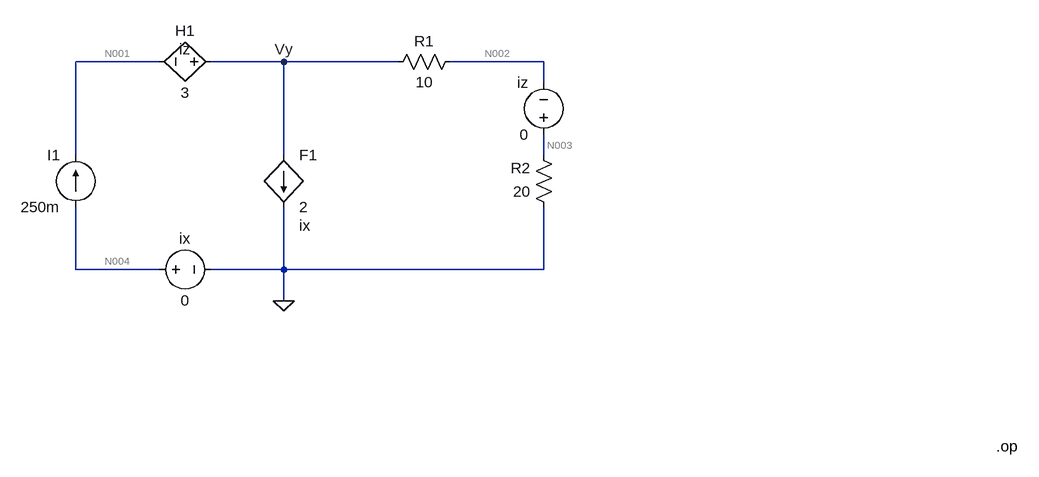
[diagram p0: schematic Lab03_01.asc]
Lab03_01.asc, the LTspice schematic file:
Version 4
SHEET 1 1408 680
WIRE 80 -80 -48 -80
WIRE 272 -80 160 -80
WIRE 448 -80 272 -80
WIRE 672 -80 528 -80
WIRE 672 -48 672 -80
WIRE -48 64 -48 -80
WIRE 272 64 272 -80
WIRE 672 64 672 32
WIRE -48 240 -48 144
WIRE 80 240 -48 240
WIRE 272 240 272 144
WIRE 272 240 160 240
WIRE 672 240 672 144
WIRE 672 240 272 240
WIRE 272 288 272 240
FLAG 272 288 0
FLAG 272 -80 Vy
SYMBOL current -48 144 R180
WINDOW 0 24 80 Left 2
WINDOW 3 24 0 Left 2
SYMATTR InstName I1
SYMATTR Value 250m
SYMBOL h 176 -80 R90
WINDOW 0 -32 56 VBottom 2
WINDOW 3 32 56 VTop 2
WINDOW 38 -4 56 VBottom 2
SYMATTR InstName H1
SYMATTR Value 3
SYMATTR SpiceModel iz
SYMBOL f 272 64 R0
WINDOW 38 24 108 Left 2
SYMATTR InstName F1
SYMATTR Value 2
SYMATTR SpiceModel ix
SYMBOL res 544 -96 R90
WINDOW 0 0 56 VBottom 2
WINDOW 3 32 56 VTop 2
SYMATTR InstName R1
SYMATTR Value 10
SYMBOL res 688 160 R180
WINDOW 0 36 76 Left 2
WINDOW 3 36 40 Left 2
SYMATTR InstName R2
SYMATTR Value 20
SYMBOL voltage 64 240 R270
WINDOW 0 32 56 VTop 2
WINDOW 3 -32 56 VBottom 2
SYMATTR InstName ix
SYMATTR Value 0
SYMBOL voltage 672 48 R180
WINDOW 0 24 96 Left 2
WINDOW 3 24 16 Left 2
SYMATTR InstName iz
SYMATTR Value 0
TEXT 1368 512 Left 2 !.op

The netlist it stands for:
* Lab03_01.asc
I1 N004 N001 250m
H1 Vy N001 iz 3
F1 Vy 0 ix 2
R1 N002 Vy 10
R2 0 N003 20
V§ix N004 0 0
V§iz N003 N002 0
.op
.backanno
.end

* Results of the author's LTspice run, read from the files saved beside the schematic
* Operating Point:
*   V(n004) = 0 V
*   V(n001) = 24.75 V
*   V(vy) = 22.5 V
*   V(n002) = 15 V
*   V(n003) = 15 V
*   I(F1) = -500 mA
*   I(H1) = -250 mA
*   I(I1) = 250 mA
*   I(R1) = -750 mA
*   I(R2) = -750 mA
*   I(Ix) = -250 mA
*   I(Iz) = -750 mA